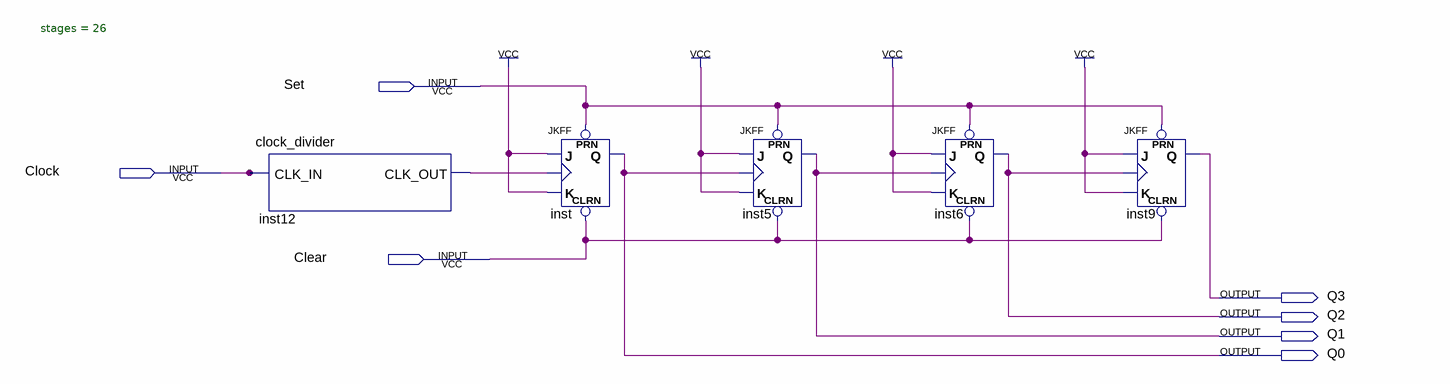
[diagram p0: schematic sheet]
// Quartus schematic Counter2_Clkd.bdf as structural Verilog: 5 symbols, 7 pins
module Counter2_Clkd (
  input  Set,
  input  Clock,
  input  Clear,
  output Q3,
  output Q2,
  output Q1,
  output Q0
);

  wire inst12_clk_out;

  clock_divider #(.stages(26)) inst12 (.CLK_IN(Clock), .CLK_OUT(inst12_clk_out));
  JKFF inst (.PRN(Set), .CLRN(Clear), .K(1'b1), .J(1'b1), .CLK(inst12_clk_out), .Q(Q0));
  JKFF inst5 (.PRN(Set), .CLRN(Clear), .K(1'b1), .J(1'b1), .CLK(Q0), .Q(Q1));
  JKFF inst6 (.PRN(Set), .CLRN(Clear), .K(1'b1), .J(1'b1), .CLK(Q1), .Q(Q2));
  JKFF inst9 (.PRN(Set), .CLRN(Clear), .K(1'b1), .J(1'b1), .CLK(Q2), .Q(Q3));
endmodule
